# Altium schematic sheet Main.SchDoc
size A4; SheetNumber: 1
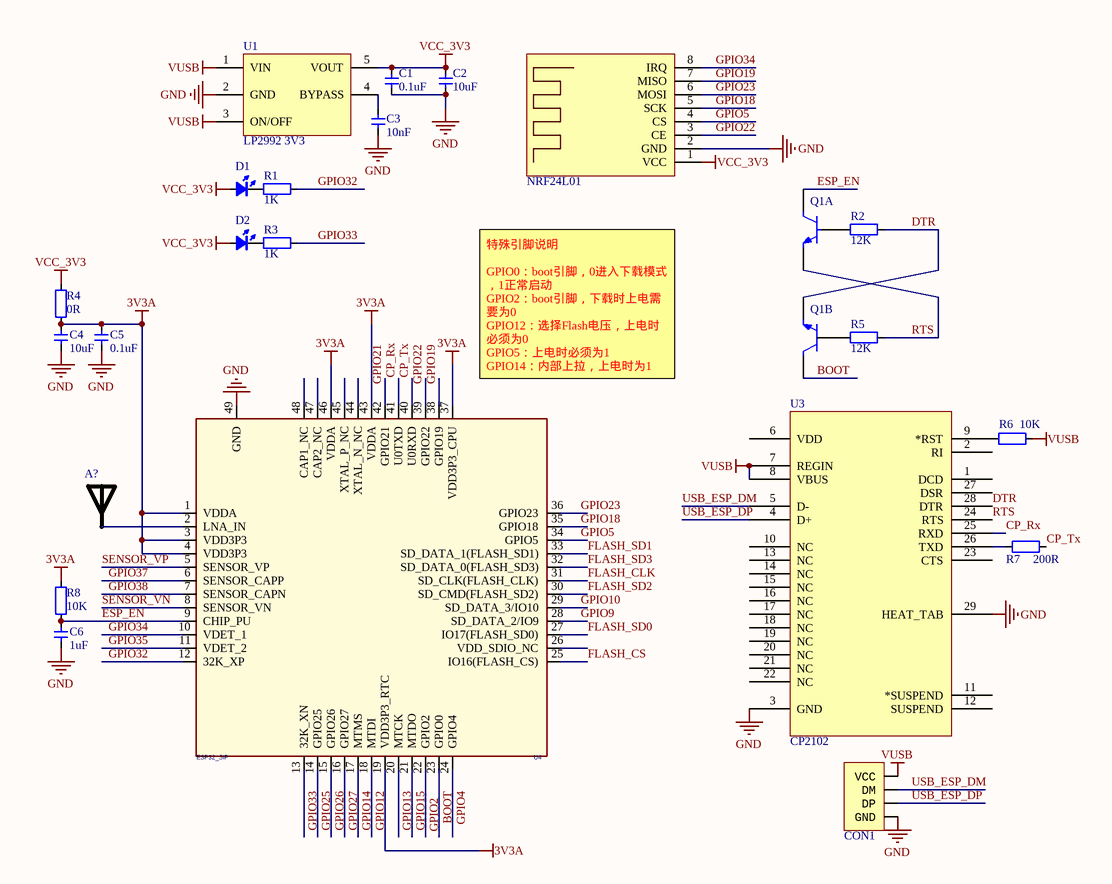
[diagram p0: Main.SchDoc]

## Parts
A?  RAINSUN  [ANT-Rainsun-AN5120]  (value not drawn)
C1  0.1uF  [CAP_0402]
C2  10uF  [CAP_0402]
C3  10nF  [CAP_0402]
C4  10uF  [CAP_0402]
C5  0.1uF  [CAP_0402]
C6  1uF  [CAP_0402]
CON1  USB_Plug_TypeA  [USB_Plug_TypeA]  (value not drawn)
D1  color?  [LED_0402_RED]  (value not drawn)
D2  color?  [LED_0402_RED]  (value not drawn)
Q1  BC847BVC-7  [SOT563-6]  (value not drawn)  (parts A,B of 2)
R1  1K  [RES_0402]
R2  12K  [RES_0402]
R3  1K  [RES_0402]
R4  0R  [RES_0402]
R5  12K  [RES_0402]
R6  10K  [RES_0402]
R7  200R  [RES_0402]
R8  10K  [RES_0402]
U1  LP2992 3V3  [SOT23-5]
U2  NRF24L01  [NRF24L01-MODULE]
U3  CP2102  [QFN-28]
U4  ESP32_SIP  [QFN-48_7X7]

## Nets
3V3A: C4.2 C5.2 R4.2 R8.1 U4.1(VDDA) U4.3(VDD3P3) U4.4(VDD3P3) U4.19(VDD3P3_RTC) U4.37(VDD3P3_CPU) U4.43(VDDA) U4.46(VDDA)
GND: C1.1 C2.1 C3.1 C4.1 C5.1 C6.2 CON1.4(GND) U1.2(GND) U2.2(GND) U3.3(GND) U3.29(HEAT_TAB) U4.49(GND)
VCC_3V3: C1.2 C2.2 D1.1(A) D2.1(A) R4.1 U1.5(VOUT) U2.1(VCC)
VUSB: CON1.1(VCC) R6.1 U1.1(VIN) U1.3(ON/OFF) U3.7(REGIN) U3.8(VBUS)
BOOT: Q1.3(C2) U4.23(GPIO0)
CP_Rx: U3.25(RXD) U4.41(U0TXD)
CP_Tx: R7.1 U4.40(U0RXD)
DTR: Q1.4(E2) R2.1 U3.28(DTR)
ESP_EN: C6.1 Q1.6(C1) R8.2 U4.9(CHIP_PU)
FLASH_CLK: U4.31(SD_CLK(FLASH_CLK))
FLASH_CS: U4.25(IO16(FLASH_CS))
FLASH_SD0: U4.27(IO17(FLASH_SD0))
FLASH_SD1: U4.33(SD_DATA_1(FLASH_SD1))
FLASH_SD2: U4.30(SD_CMD(FLASH_SD2))
FLASH_SD3: U4.32(SD_DATA_0(FLASH_SD3))
GPIO2: U4.22(GPIO2)
GPIO4: U4.24(GPIO4)
GPIO5: U2.4(CS) U4.34(GPIO5)
GPIO9: U4.28(SD_DATA_2/IO9)
GPIO10: U4.29(SD_DATA_3/IO10)
GPIO12: U4.18(MTDI)
GPIO13: U4.20(MTCK)
GPIO14: U4.17(MTMS)
GPIO15: U4.21(MTDO)
GPIO18: U2.5(SCK) U4.35(GPIO18)
GPIO19: U2.7(MISO) U4.38(GPIO19)
GPIO21: U4.42(GPIO21)
GPIO22: U2.3(CE) U4.39(GPIO22)
GPIO23: U2.6(MOSI) U4.36(GPIO23)
GPIO25: U4.14(GPIO25)
GPIO26: U4.15(GPIO26)
GPIO27: U4.16(GPIO27)
GPIO32: R1.2 U4.12(32K_XP)
GPIO33: R3.2 U4.13(32K_XN)
GPIO34: U2.8(IRQ) U4.10(VDET_1)
GPIO35: U4.11(VDET_2)
GPIO37: U4.6(SENSOR_CAPP)
GPIO38: U4.7(SENSOR_CAPN)
RTS: Q1.1(E1) R5.1 U3.24(RTS)
SENSOR_VN: U4.8(SENSOR_VN)
SENSOR_VP: U4.5(SENSOR_VP)
USB_ESP_DM: CON1.2(DM) U3.5(D-)
USB_ESP_DP: CON1.3(DP) U3.4(D+)
NetA?_1: A?.1 U4.2(LNA_IN)
NetC3_2: C3.2 U1.4(BYPASS)
NetD1_2: D1.2(K) R1.1
NetD2_2: D2.2(K) R3.1
NetQ1_2: Q1.2(B1) R2.2
NetQ1_5: Q1.5(B2) R5.2
NetR6_2: R6.2 U3.9(*RST)
NetR7_2: R7.2 U3.26(TXD)

Not connected (* = marked no-connect by the designer): U3 1(DCD) 2(RI) 6(VDD) 10(NC) 11(*SUSPEND) 12(SUSPEND) 13(NC) 14(NC) 15(NC) 16(NC) 17(NC) 18(NC) 19(NC) 20(NC) 21(NC) 22(NC) 23(CTS) 27(DSR); U4 26(VDD_SDIO_NC) 44(XTAL_N_NC) 45(XTAL_P_NC) 47(CAP2_NC) 48(CAP1_NC)

## Notes on the sheet
- (near U4) 特殊引脚说明
  GPIO0：boot引脚，0进入下载模式，1正常启动
  GPIO2：boot引脚，下载时上电需要为0
  GPIO12：选择Flash电压，上电时必须为0
  GPIO5：上电时必须为1
  GPIO14：内部上拉，上电时为1
  GPIO15：上电时必须为1

## Library data of the parts
A? = ANT-Rainsun-AP5120
C1-C6 = 电容-0402: Capacitor; Value: 0.1u
CON1 = USB_Plug_TypeA: USB
D1 D2 = LED_0402: LED; Type: 0402; Value: color?
R1-R8 = 电阻-0402: Resistor; Value: 22R
U1 = LP2992: LDO
U2 = NRF24L01模块
U3 = CP2102: USB转TTL; PART DESC: SINGLE-CHIP USB TO UART BRIDGE, QFN28, RoHS.; MFG #1: SILICON LABS; PART NUMBER: CP2102; Value: Value; RefDes: RefDes; Type: DEV
U4 = ESP32-PICO